# Altium schematic sheet Dev.SchDoc
size 292 x 193 mm; Author: Power Lin; DocumentNumber: 3; SheetNumber: 3; SheetTotal: 4; Website: wiki-power.com
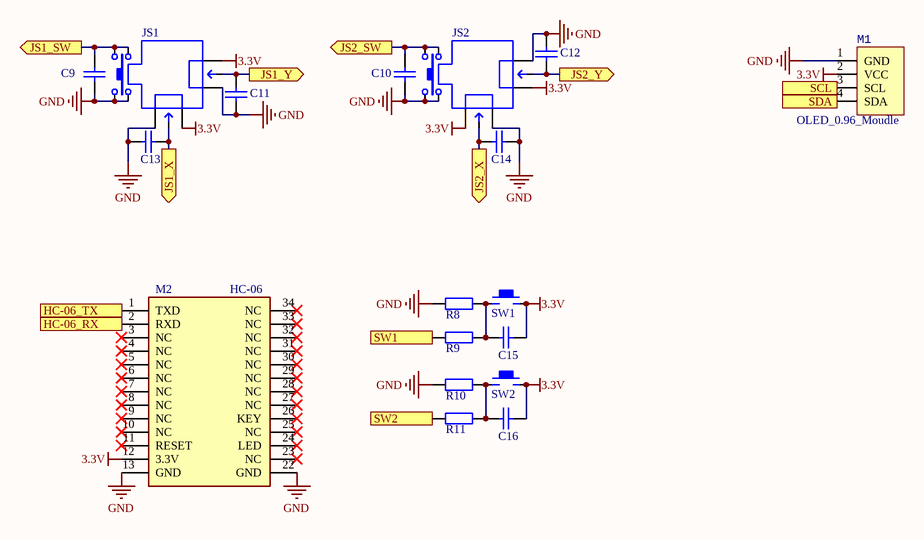
[diagram p0: Dev.SchDoc]

## Parts
C9  220pF  [CAP-0603]  (value not drawn)
C10  220pF  [CAP-0603]  (value not drawn)
C11  220pF  [CAP-0603]  (value not drawn)
C12  220pF  [CAP-0603]  (value not drawn)
C13  220pF  [CAP-0603]  (value not drawn)
C14  220pF  [CAP-0603]  (value not drawn)
C15  100nF  [CAP-0603]  (value not drawn)
C16  100nF  [CAP-0603]  (value not drawn)
JS1  JoyStick  [JoyStick]  (value not drawn)
JS2  JoyStick  [JoyStick]  (value not drawn)
M1  OLED_0.96_Moudle  [OLED_0.96_Moudle]
M2  HC-06  [HC-05/06/08V15]
R8  4.7k  [R-0603]  (value not drawn)
R9  1k  [R-0603]  (value not drawn)
R10  4.7k  [R-0603]  (value not drawn)
R11  1k  [R-0603]  (value not drawn)
SW1  KEY  [KEY_12*12*7.3]  (value not drawn)
SW2  KEY  [KEY_12*12*7.3]  (value not drawn)

## Ports
HC-06_RX (in), HC-06_TX (out), JS1_SW (out), JS1_X (out), JS1_Y (out), JS2_SW (out), JS2_X (out), JS2_Y (out), SCL (out), SDA (out), SW1 (out), SW2 (out)

## Nets
3.3V: C15.2 C16.2 JS1.3 JS1.6 JS2.1 JS2.4 M1.2(VCC) M2.12(3.3V) SW1.2 SW2.2
GND: C9.1 C10.1 C11.1 C12.2 C13.2 C14.1 JS1.1 JS1.4 JS1.8 JS1.10 JS2.3 JS2.6 JS2.8 JS2.10 M1.1(GND) M2.13(GND) M2.22(GND) R8.1 R10.1
HC-06_RX: M2.2(RXD) ; port HC-06_RX
HC-06_TX: M2.1(TXD) ; port HC-06_TX
JS1_SW: C9.2 JS1.7 JS1.9 ; port JS1_SW
JS1_X: C13.1 JS1.2 ; port JS1_X
JS1_Y: C11.2 JS1.5 ; port JS1_Y
JS2_SW: C10.2 JS2.7 JS2.9 ; port JS2_SW
JS2_X: C14.2 JS2.2 ; port JS2_X
JS2_Y: C12.1 JS2.5 ; port JS2_Y
SCL: M1.3(SCL) ; port SCL
SDA: M1.4(SDA) ; port SDA
SW1: R9.1 ; port SW1
SW2: R11.1 ; port SW2
NetC15_1: C15.1 R8.2 R9.2 SW1.1
NetC16_1: C16.1 R10.2 R11.2 SW2.1

Not connected (* = marked no-connect by the designer): M2 3(NC)* 4(NC)* 5(NC)* 6(NC)* 7(NC)* 8(NC)* 9(NC)* 10(NC)* 11(RESET)* 23(NC)* 24(LED)* 25(NC)* 26(KEY)* 27(NC)* 28(NC)* 29(NC)* 30(NC)* 31(NC)* 32(NC)* 33(NC)* 34(NC)*

## Notes on the sheet
- Author
- DocumentName
- ModifiedDate
- ProjectName
- SheetNumber
- SheetTotal
- Website
- Revision

## Library data of the parts
C9-C16 = CAP: 贴片电容; ComponentLink1Description: 供应商链接; ComponentLink1URL: http://www.szlcsc.com/product/details_53938.html; Package: 0402; Supplier: LC; SuppliersPartNumber: C52923
JS1 JS2 = JoyStick: 摇杆
M1 = OLED_0.96_Moudle: OLED 屏
M2 = HC-05/06: HC05/06 蓝牙模块（贴片）; Manufacturer_Name: FTDI Chip; Manufacturer_Part_Number: FT232RL; Datasheet Link: http://www.ftdichip.com/Support/Documents/DataSheets/ICs/DS_FT232R.pdf; Height: 2mm; RS Part Number: 0406580P; RS Price/Stock: http://uk.rs-online.com/web/p/products/0406580P
R8-R11 = RES: 贴片电阻; Package: 0805; Supplier: LC; SuppliersPartNumber: C17798
SW1 SW2 = KEY: 按键开关